# Altium schematic sheet Core.SchDoc
size A3; Organization: Altium Limited; Address1: L3, 12a Rodborough Rd; Address2: Frenchs Forest; Address3: NSW; Address4: Australia 2086
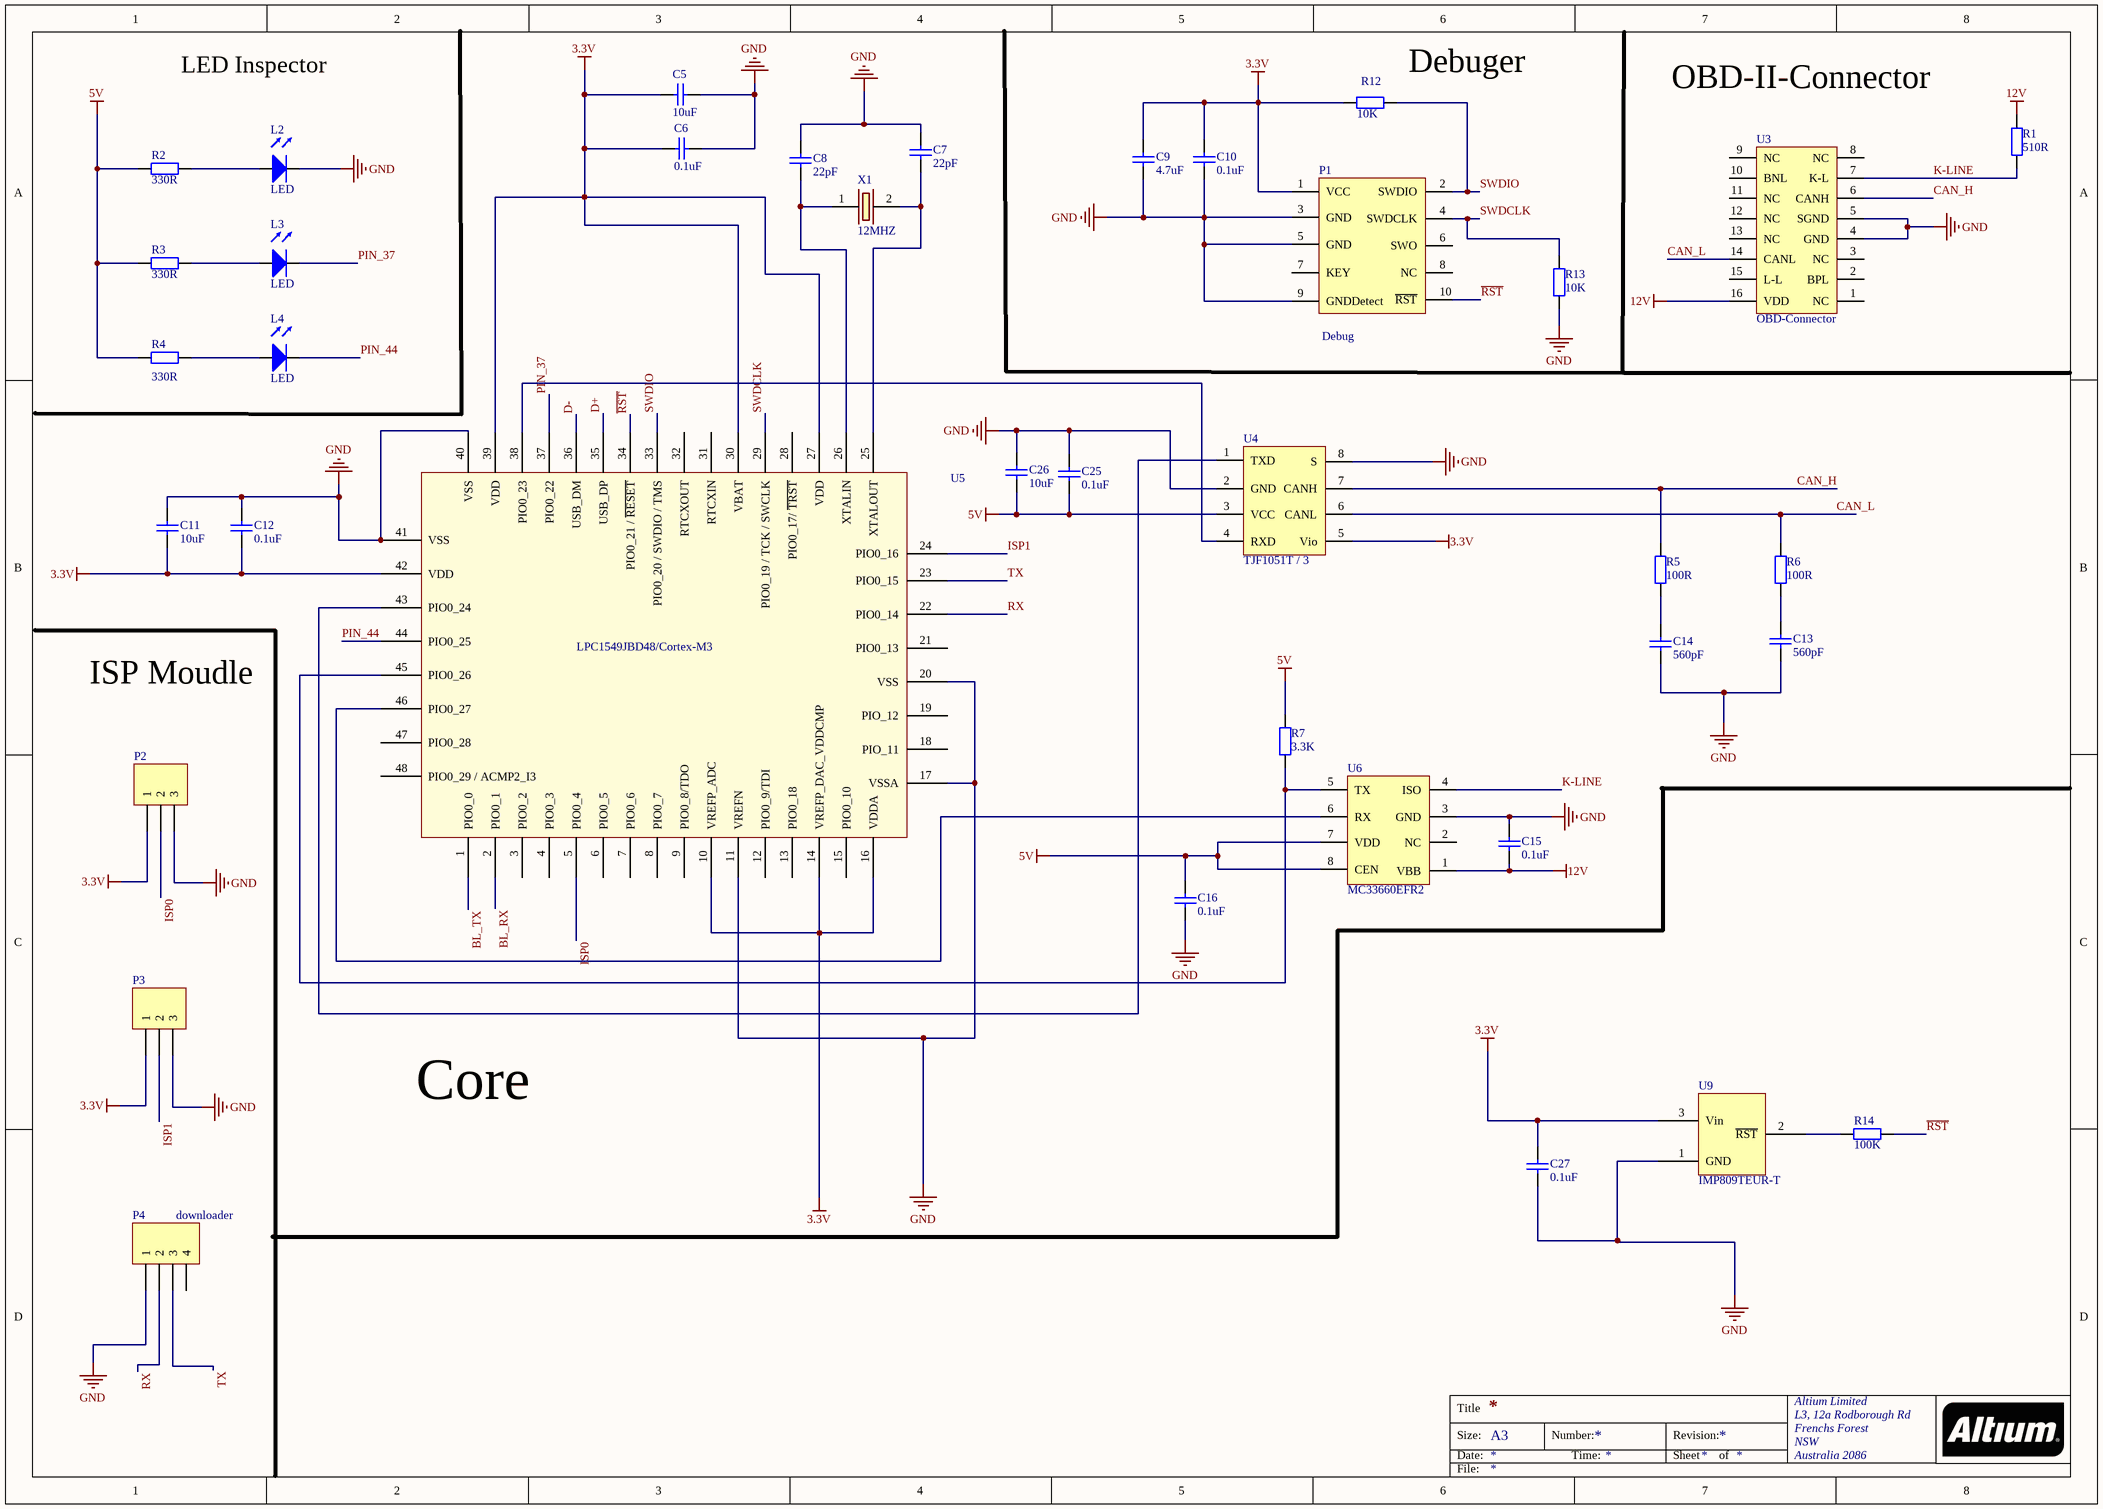
[diagram p0: Core.SchDoc]

## Parts
C5  10uF  [0603]
C6  0.1uF  [0603]
C7  22pF  [0603]
C8  22pF  [0603]
C9  4.7uF  [0603]
C10  0.1uF  [0603]
C11  10uF  [0603]
C12  0.1uF  [0603]
C13  560pF  [0603]
C14  560pF  [0603]
C15  0.1uF  [0603]
C16  0.1uF  [0603]
C25  0.1uF  [0603]
C26  10uF  [0603]
C27  0.1uF  [0603]
L2  LED  [0805]
L3  LED  [0805]
L4  LED  [0805]
P1  Debug  [JATG_10pin]
P2  (no value)  [HDR1X3]
P3  (no value)  [HDR1X3]
P4  downloader  [HDR1X4]
R1  510R  [0603]
R2  330R  [0603]
R3  330R  [0603]
R4  330R  [0603]
R5  100R  [0603]
R6  100R  [0603]
R7  3.3K  [0603]
R12  10K  [0603]
R13  10K  [0603]
R14  100K  [0603]
U3  OBD-Connector  [OBD-MaleConnector]
U4  TJF1051T / 3  [TJF1051]
U5  LPC1549  [LPC1549JBD48]  (value not drawn)
U6  MC33660EFR2  [SOP-8]
U9  IMP809TEUR-T  [SOT23-3]
X1  12MHZ  [12Mhz-DFN]

## Nets
3.3V: C5.2 C6.2 C9.2 C10.2 C11.1 C12.1 C27.2 P1.1(VCC) P2.1 P3.1 R12.1 U4.5(Vio) U5.10(VREFP_ADC) U5.14(VREFP_DAC_VDDCMP) U5.16(VDDA) U5.27(VDD) U5.30(VBAT) U5.39(VDD) U5.42(VDD) U9.3(Vin)
5V: C16.2 C25.1 C26.1 R2.1 R3.1 R4.1 R7.2 U4.3(VCC) U6.7(VDD) U6.8(CEN)
12V: C15.1 R1.2 U3.16(VDD) U6.1(VBB)
GND: C5.1 C6.1 C7.2 C8.2 C9.1 C10.1 C11.2 C12.2 C13.1 C14.1 C15.2 C16.1 C25.2 C26.2 C27.1 L2.2(K) P1.3(GND) P1.5(GND) P1.9(GNDDetect) P2.3 P3.3 P4.1 R13.1 U3.4(GND) U3.5(SGND) U4.2(GND) U4.8(S) U5.11(VREFN) U5.17(VSSA) U5.20(VSS) U5.40(VSS) U5.41(VSS) U6.3(GND) U9.1(GND)
BL_RX: U5.2(PIO0_1)
BL_TX: U5.1(PIO0_0)
CAN_H: R5.2 U3.6(CANH) U4.7(CANH)
CAN_L: R6.2 U3.14(CANL) U4.6(CANL)
D+: U5.35(USB_DP)
D-: U5.36(USB_DM)
ISP0: P2.2 U5.5(PIO0_4)
ISP1: P3.2 U5.24(PIO0_16)
K-LINE: R1.1 U3.7(K-L) U6.4(ISO)
PIN_37: L3.2(K) U5.37(PIO0_22)
PIN_44: L4.2(K) U5.44(PIO0_25)
~{RST}: P1.10(~{RST}) R14.1 U5.34(PIO0_21_/_~{RESET})
RX: P4.2 U5.22(PIO0_14)
SWDCLK: P1.4(SWDCLK) R13.2 U5.29(PIO0_19_/_TCK_/_SWCLK)
SWDIO: P1.2(SWDIO) R12.2 U5.33(PIO0_20_/_SWDIO_/_TMS)
TX: P4.3 U5.23(PIO0_15)
NetC7_1: C7.1 U5.25(XTALOUT) X1.2
NetC8_1: C8.1 U5.26(XTALIN) X1.1
NetC13_2: C13.2 R6.1
NetC14_2: C14.2 R5.1
NetL2_1: L2.1(A) R2.2
NetL3_1: L3.1(A) R3.2
NetL4_1: L4.1(A) R4.2
NetR7_1: R7.1 U5.45(PIO0_26) U6.5(TX)
NetR14_2: R14.2 U9.2(~{RST})
NetU4_1: U4.1(TXD) U5.43(PIO0_24)
NetU4_4: U4.4(RXD) U5.38(PIO0_23)
NetU5_46: U5.46(PIO0_27) U6.6(RX)

Not connected (* = marked no-connect by the designer): P1 6(SWO) 7(KEY) 8(NC); P4 4; U3 1(NC) 2(BPL) 3(NC) 8(NC) 9(NC) 10(BNL) 11(NC) 12(NC) 13(NC) 15(L-L); U5 3(PIO0_2) 4(PIO0_3) 6(PIO0_5) 7(PIO0_6) 8(PIO0_7) 9(PIO0_8/TDO) 12(PIO0_9/TDI) 13(PIO0_18) 15(PIO0_10) 18(PIO_11) 19(PIO_12) 21(PIO0_13) 28(PIO0_17/_~{TRST}) 31(RTCXIN) 32(RTCXOUT) 47(PIO0_28) 48(PIO0_29_/_ACMP2_I3); U6 2(NC)

## Notes on the sheet
- LED Inspector
- (near R12) Debuger
- OBD-II-Connector
- ISP Moudle
- Core
- Title
- Size:
- Date:
- A3
- Number:
- Time:
- Revision:
- Sheet
- of
- File:
- (in symbol LPC1549JBD48) LPC1549JBD48/Cortex-M3

## Library data of the parts
C5-C16 C25-C27 = Cap1: ceramic
P1 = JTAG_10Pin
P2 P3 = Header 3: Header, 3-Pin; LatestRevisionDate: 17-Jul-2002; LatestRevisionNote: Re-released for DXP Platform.; Publisher: Altium Limited
P4 = Header 4: Header, 4-Pin; LatestRevisionDate: 17-Jul-2002; LatestRevisionNote: Re-released for DXP Platform.; Publisher: Altium Limited
R1-R7 R12-R14 = Res
U3 = OBD-MaleHead
U5 = LPC1549JBD48
X1 = OSC